# Altium schematic sheet Balancing_FETs.SchDoc
size A4; Organization: TESLA Motors, INC; Address1: 3500 Deer Creek Road; Address2: Palo Alto, CA; Address4: U.S.A.; SheetNumber: 4; SheetTotal: 8
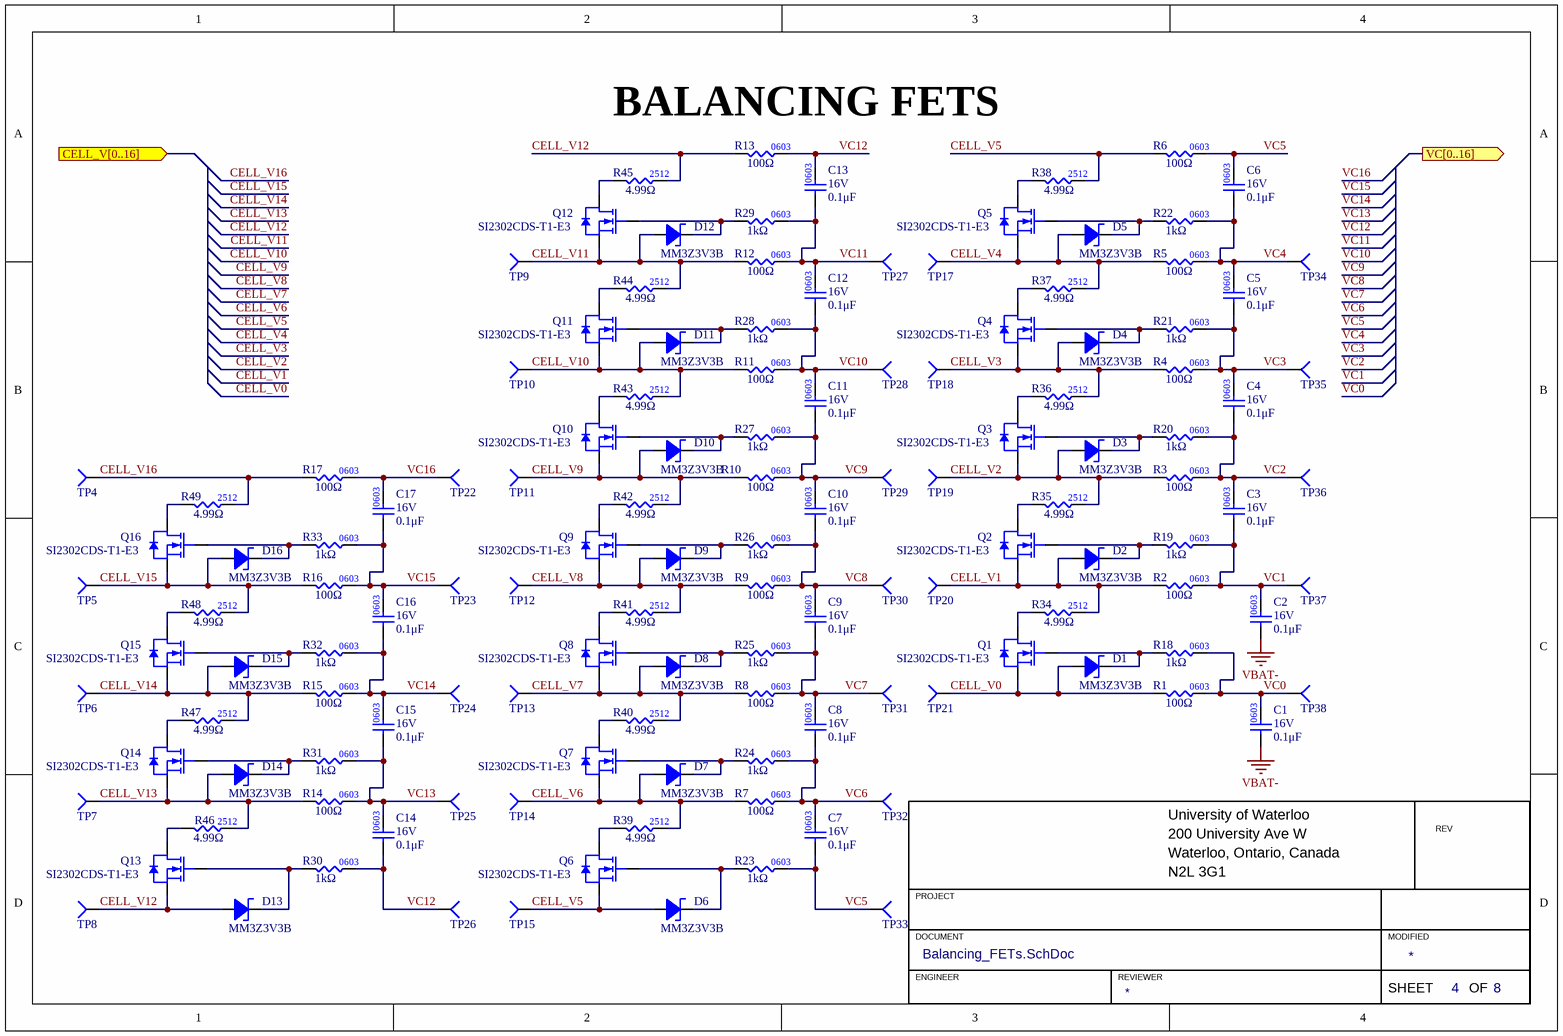
[diagram p0: Balancing_FETs.SchDoc]

## Parts
C1  value 0.1μF  Voltage Rating: 16V  [CAP0603]  (hidden comment: CAP_0.1uF_16V_0603)
C2  value 0.1μF  Voltage Rating: 16V  [CAP0603]  (hidden comment: CAP_0.1uF_16V_0603)
C3  value 0.1μF  Voltage Rating: 16V  [CAP0603]  (hidden comment: CAP_0.1uF_16V_0603)
C4  value 0.1μF  Voltage Rating: 16V  [CAP0603]  (hidden comment: CAP_0.1uF_16V_0603)
C5  value 0.1μF  Voltage Rating: 16V  [CAP0603]  (hidden comment: CAP_0.1uF_16V_0603)
C6  value 0.1μF  Voltage Rating: 16V  [CAP0603]  (hidden comment: CAP_0.1uF_16V_0603)
C7  value 0.1μF  Voltage Rating: 16V  [CAP0603]  (hidden comment: CAP_0.1uF_16V_0603)
C8  value 0.1μF  Voltage Rating: 16V  [CAP0603]  (hidden comment: CAP_0.1uF_16V_0603)
C9  value 0.1μF  Voltage Rating: 16V  [CAP0603]  (hidden comment: CAP_0.1uF_16V_0603)
C10  value 0.1μF  Voltage Rating: 16V  [CAP0603]  (hidden comment: CAP_0.1uF_16V_0603)
C11  value 0.1μF  Voltage Rating: 16V  [CAP0603]  (hidden comment: CAP_0.1uF_16V_0603)
C12  value 0.1μF  Voltage Rating: 16V  [CAP0603]  (hidden comment: CAP_0.1uF_16V_0603)
C13  value 0.1μF  Voltage Rating: 16V  [CAP0603]  (hidden comment: CAP_0.1uF_16V_0603)
C14  value 0.1μF  Voltage Rating: 16V  [CAP0603]  (hidden comment: CAP_0.1uF_16V_0603)
C15  value 0.1μF  Voltage Rating: 16V  [CAP0603]  (hidden comment: CAP_0.1uF_16V_0603)
C16  value 0.1μF  Voltage Rating: 16V  [CAP0603]  (hidden comment: CAP_0.1uF_16V_0603)
C17  value 0.1μF  Voltage Rating: 16V  [CAP0603]  (hidden comment: CAP_0.1uF_16V_0603)
D1  Manufacturer Part Number 1: MM3Z3V3B  [DIO_ZENER_3V3]  (hidden comment: DIO_ZENER_3V3)
D2  Manufacturer Part Number 1: MM3Z3V3B  [DIO_ZENER_3V3]  (hidden comment: DIO_ZENER_3V3)
D3  Manufacturer Part Number 1: MM3Z3V3B  [DIO_ZENER_3V3]  (hidden comment: DIO_ZENER_3V3)
D4  Manufacturer Part Number 1: MM3Z3V3B  [DIO_ZENER_3V3]  (hidden comment: DIO_ZENER_3V3)
D5  Manufacturer Part Number 1: MM3Z3V3B  [DIO_ZENER_3V3]  (hidden comment: DIO_ZENER_3V3)
D6  Manufacturer Part Number 1: MM3Z3V3B  [DIO_ZENER_3V3]  (hidden comment: DIO_ZENER_3V3)
D7  Manufacturer Part Number 1: MM3Z3V3B  [DIO_ZENER_3V3]  (hidden comment: DIO_ZENER_3V3)
D8  Manufacturer Part Number 1: MM3Z3V3B  [DIO_ZENER_3V3]  (hidden comment: DIO_ZENER_3V3)
D9  Manufacturer Part Number 1: MM3Z3V3B  [DIO_ZENER_3V3]  (hidden comment: DIO_ZENER_3V3)
D10  Manufacturer Part Number 1: MM3Z3V3B  [DIO_ZENER_3V3]  (hidden comment: DIO_ZENER_3V3)
D11  Manufacturer Part Number 1: MM3Z3V3B  [DIO_ZENER_3V3]  (hidden comment: DIO_ZENER_3V3)
D12  Manufacturer Part Number 1: MM3Z3V3B  [DIO_ZENER_3V3]  (hidden comment: DIO_ZENER_3V3)
D13  Manufacturer Part Number 1: MM3Z3V3B  [DIO_ZENER_3V3]  (hidden comment: DIO_ZENER_3V3)
D14  Manufacturer Part Number 1: MM3Z3V3B  [DIO_ZENER_3V3]  (hidden comment: DIO_ZENER_3V3)
D15  Manufacturer Part Number 1: MM3Z3V3B  [DIO_ZENER_3V3]  (hidden comment: DIO_ZENER_3V3)
D16  Manufacturer Part Number 1: MM3Z3V3B  [DIO_ZENER_3V3]  (hidden comment: DIO_ZENER_3V3)
Q1  Manufacturer Part Number 1: SI2302CDS-T1-E3  [SOT23-3]  (hidden comment: NMOS_20V_6A)
Q2  Manufacturer Part Number 1: SI2302CDS-T1-E3  [SOT23-3]  (hidden comment: NMOS_20V_6A)
Q3  Manufacturer Part Number 1: SI2302CDS-T1-E3  [SOT23-3]  (hidden comment: NMOS_20V_6A)
Q4  Manufacturer Part Number 1: SI2302CDS-T1-E3  [SOT23-3]  (hidden comment: NMOS_20V_6A)
Q5  Manufacturer Part Number 1: SI2302CDS-T1-E3  [SOT23-3]  (hidden comment: NMOS_20V_6A)
Q6  Manufacturer Part Number 1: SI2302CDS-T1-E3  [SOT23-3]  (hidden comment: NMOS_20V_6A)
Q7  Manufacturer Part Number 1: SI2302CDS-T1-E3  [SOT23-3]  (hidden comment: NMOS_20V_6A)
Q8  Manufacturer Part Number 1: SI2302CDS-T1-E3  [SOT23-3]  (hidden comment: NMOS_20V_6A)
Q9  Manufacturer Part Number 1: SI2302CDS-T1-E3  [SOT23-3]  (hidden comment: NMOS_20V_6A)
Q10  Manufacturer Part Number 1: SI2302CDS-T1-E3  [SOT23-3]  (hidden comment: NMOS_20V_6A)
Q11  Manufacturer Part Number 1: SI2302CDS-T1-E3  [SOT23-3]  (hidden comment: NMOS_20V_6A)
Q12  Manufacturer Part Number 1: SI2302CDS-T1-E3  [SOT23-3]  (hidden comment: NMOS_20V_6A)
Q13  Manufacturer Part Number 1: SI2302CDS-T1-E3  [SOT23-3]  (hidden comment: NMOS_20V_6A)
Q14  Manufacturer Part Number 1: SI2302CDS-T1-E3  [SOT23-3]  (hidden comment: NMOS_20V_6A)
Q15  Manufacturer Part Number 1: SI2302CDS-T1-E3  [SOT23-3]  (hidden comment: NMOS_20V_6A)
Q16  Manufacturer Part Number 1: SI2302CDS-T1-E3  [SOT23-3]  (hidden comment: NMOS_20V_6A)
R1  value 100Ω  [RES0603]  (hidden comment: RES_100Ω_0603_1%)
R2  value 100Ω  [RES0603]  (hidden comment: RES_100Ω_0603_1%)
R3  value 100Ω  [RES0603]  (hidden comment: RES_100Ω_0603_1%)
R4  value 100Ω  [RES0603]  (hidden comment: RES_100Ω_0603_1%)
R5  value 100Ω  [RES0603]  (hidden comment: RES_100Ω_0603_1%)
R6  value 100Ω  [RES0603]  (hidden comment: RES_100Ω_0603_1%)
R7  value 100Ω  [RES0603]  (hidden comment: RES_100Ω_0603_1%)
R8  value 100Ω  [RES0603]  (hidden comment: RES_100Ω_0603_1%)
R9  value 100Ω  [RES0603]  (hidden comment: RES_100Ω_0603_1%)
R10  value 100Ω  [RES0603]  (hidden comment: RES_100Ω_0603_1%)
R11  value 100Ω  [RES0603]  (hidden comment: RES_100Ω_0603_1%)
R12  value 100Ω  [RES0603]  (hidden comment: RES_100Ω_0603_1%)
R13  value 100Ω  [RES0603]  (hidden comment: RES_100Ω_0603_1%)
R14  value 100Ω  [RES0603]  (hidden comment: RES_100Ω_0603_1%)
R15  value 100Ω  [RES0603]  (hidden comment: RES_100Ω_0603_1%)
R16  value 100Ω  [RES0603]  (hidden comment: RES_100Ω_0603_1%)
R17  value 100Ω  [RES0603]  (hidden comment: RES_100Ω_0603_1%)
R18  value 1kΩ  [RES0603]  (hidden comment: RES_1kΩ_0603_1%)
R19  value 1kΩ  [RES0603]  (hidden comment: RES_1kΩ_0603_1%)
R20  value 1kΩ  [RES0603]  (hidden comment: RES_1kΩ_0603_1%)
R21  value 1kΩ  [RES0603]  (hidden comment: RES_1kΩ_0603_1%)
R22  value 1kΩ  [RES0603]  (hidden comment: RES_1kΩ_0603_1%)
R23  value 1kΩ  [RES0603]  (hidden comment: RES_1kΩ_0603_1%)
R24  value 1kΩ  [RES0603]  (hidden comment: RES_1kΩ_0603_1%)
R25  value 1kΩ  [RES0603]  (hidden comment: RES_1kΩ_0603_1%)
R26  value 1kΩ  [RES0603]  (hidden comment: RES_1kΩ_0603_1%)
R27  value 1kΩ  [RES0603]  (hidden comment: RES_1kΩ_0603_1%)
R28  value 1kΩ  [RES0603]  (hidden comment: RES_1kΩ_0603_1%)
R29  value 1kΩ  [RES0603]  (hidden comment: RES_1kΩ_0603_1%)
R30  value 1kΩ  [RES0603]  (hidden comment: RES_1kΩ_0603_1%)
R31  value 1kΩ  [RES0603]  (hidden comment: RES_1kΩ_0603_1%)
R32  value 1kΩ  [RES0603]  (hidden comment: RES_1kΩ_0603_1%)
R33  value 1kΩ  [RES0603]  (hidden comment: RES_1kΩ_0603_1%)
R34  value 4.99Ω  [RES2512]  (hidden comment: RES_4.99Ω_2512_1%)
R35  value 4.99Ω  [RES2512]  (hidden comment: RES_4.99Ω_2512_1%)
R36  value 4.99Ω  [RES2512]  (hidden comment: RES_4.99Ω_2512_1%)
R37  value 4.99Ω  [RES2512]  (hidden comment: RES_4.99Ω_2512_1%)
R38  value 4.99Ω  [RES2512]  (hidden comment: RES_4.99Ω_2512_1%)
R39  value 4.99Ω  [RES2512]  (hidden comment: RES_4.99Ω_2512_1%)
R40  value 4.99Ω  [RES2512]  (hidden comment: RES_4.99Ω_2512_1%)
R41  value 4.99Ω  [RES2512]  (hidden comment: RES_4.99Ω_2512_1%)
R42  value 4.99Ω  [RES2512]  (hidden comment: RES_4.99Ω_2512_1%)
R43  value 4.99Ω  [RES2512]  (hidden comment: RES_4.99Ω_2512_1%)
R44  value 4.99Ω  [RES2512]  (hidden comment: RES_4.99Ω_2512_1%)
R45  value 4.99Ω  [RES2512]  (hidden comment: RES_4.99Ω_2512_1%)
R46  value 4.99Ω  [RES2512]  (hidden comment: RES_4.99Ω_2512_1%)
R47  value 4.99Ω  [RES2512]  (hidden comment: RES_4.99Ω_2512_1%)
R48  value 4.99Ω  [RES2512]  (hidden comment: RES_4.99Ω_2512_1%)
R49  value 4.99Ω  [RES2512]  (hidden comment: RES_4.99Ω_2512_1%)
TP4  TESTPOINT_1MM_SQUARE  [TESTPOINT_SQUARE_1MM]  (value not drawn)  (no BOM)
TP5  TESTPOINT_1MM_SQUARE  [TESTPOINT_SQUARE_1MM]  (value not drawn)  (no BOM)
TP6  TESTPOINT_1MM_SQUARE  [TESTPOINT_SQUARE_1MM]  (value not drawn)  (no BOM)
TP7  TESTPOINT_1MM_SQUARE  [TESTPOINT_SQUARE_1MM]  (value not drawn)  (no BOM)
TP8  TESTPOINT_1MM_SQUARE  [TESTPOINT_SQUARE_1MM]  (value not drawn)  (no BOM)
TP9  TESTPOINT_1MM_SQUARE  [TESTPOINT_SQUARE_1MM]  (value not drawn)  (no BOM)
TP10  TESTPOINT_1MM_SQUARE  [TESTPOINT_SQUARE_1MM]  (value not drawn)  (no BOM)
TP11  TESTPOINT_1MM_SQUARE  [TESTPOINT_SQUARE_1MM]  (value not drawn)  (no BOM)
TP12  TESTPOINT_1MM_SQUARE  [TESTPOINT_SQUARE_1MM]  (value not drawn)  (no BOM)
TP13  TESTPOINT_1MM_SQUARE  [TESTPOINT_SQUARE_1MM]  (value not drawn)  (no BOM)
TP14  TESTPOINT_1MM_SQUARE  [TESTPOINT_SQUARE_1MM]  (value not drawn)  (no BOM)
TP15  TESTPOINT_1MM_SQUARE  [TESTPOINT_SQUARE_1MM]  (value not drawn)  (no BOM)
TP17  TESTPOINT_1MM_SQUARE  [TESTPOINT_SQUARE_1MM]  (value not drawn)  (no BOM)
TP18  TESTPOINT_1MM_SQUARE  [TESTPOINT_SQUARE_1MM]  (value not drawn)  (no BOM)
TP19  TESTPOINT_1MM_SQUARE  [TESTPOINT_SQUARE_1MM]  (value not drawn)  (no BOM)
TP20  TESTPOINT_1MM_SQUARE  [TESTPOINT_SQUARE_1MM]  (value not drawn)  (no BOM)
TP21  TESTPOINT_1MM_SQUARE  [TESTPOINT_SQUARE_1MM]  (value not drawn)  (no BOM)
TP22  TESTPOINT_1MM_SQUARE  [TESTPOINT_SQUARE_1MM]  (value not drawn)  (no BOM)
TP23  TESTPOINT_1MM_SQUARE  [TESTPOINT_SQUARE_1MM]  (value not drawn)  (no BOM)
TP24  TESTPOINT_1MM_SQUARE  [TESTPOINT_SQUARE_1MM]  (value not drawn)  (no BOM)
TP25  TESTPOINT_1MM_SQUARE  [TESTPOINT_SQUARE_1MM]  (value not drawn)  (no BOM)
TP26  TESTPOINT_1MM_SQUARE  [TESTPOINT_SQUARE_1MM]  (value not drawn)  (no BOM)
TP27  TESTPOINT_1MM_SQUARE  [TESTPOINT_SQUARE_1MM]  (value not drawn)  (no BOM)
TP28  TESTPOINT_1MM_SQUARE  [TESTPOINT_SQUARE_1MM]  (value not drawn)  (no BOM)
TP29  TESTPOINT_1MM_SQUARE  [TESTPOINT_SQUARE_1MM]  (value not drawn)  (no BOM)
TP30  TESTPOINT_1MM_SQUARE  [TESTPOINT_SQUARE_1MM]  (value not drawn)  (no BOM)
TP31  TESTPOINT_1MM_SQUARE  [TESTPOINT_SQUARE_1MM]  (value not drawn)  (no BOM)
TP32  TESTPOINT_1MM_SQUARE  [TESTPOINT_SQUARE_1MM]  (value not drawn)  (no BOM)
TP33  TESTPOINT_1MM_SQUARE  [TESTPOINT_SQUARE_1MM]  (value not drawn)  (no BOM)
TP34  TESTPOINT_1MM_SQUARE  [TESTPOINT_SQUARE_1MM]  (value not drawn)  (no BOM)
TP35  TESTPOINT_1MM_SQUARE  [TESTPOINT_SQUARE_1MM]  (value not drawn)  (no BOM)
TP36  TESTPOINT_1MM_SQUARE  [TESTPOINT_SQUARE_1MM]  (value not drawn)  (no BOM)
TP37  TESTPOINT_1MM_SQUARE  [TESTPOINT_SQUARE_1MM]  (value not drawn)  (no BOM)
TP38  TESTPOINT_1MM_SQUARE  [TESTPOINT_SQUARE_1MM]  (value not drawn)  (no BOM)

## Ports
CELL_V[0..16] (in), VC[0..16] (out)

## Nets
VBAT-: C1.1 C2.1
CELL_V0: D1.1(Anode) Q1.2(SOURCE) R1.1 TP21.1(=value)
CELL_V1: D2.1(Anode) Q2.2(SOURCE) R2.1 R34.2 TP20.1(=value)
CELL_V2: D3.1(Anode) Q3.2(SOURCE) R3.1 R35.2 TP19.1(=value)
CELL_V3: D4.1(Anode) Q4.2(SOURCE) R4.1 R36.2 TP18.1(=value)
CELL_V4: D5.1(Anode) Q5.2(SOURCE) R5.1 R37.2 TP17.1(=value)
CELL_V5: D6.1(Anode) Q6.2(SOURCE) R6.1 R38.2 TP15.1(=value)
CELL_V6: D7.1(Anode) Q7.2(SOURCE) R7.1 R39.2 TP14.1(=value)
CELL_V7: D8.1(Anode) Q8.2(SOURCE) R8.1 R40.2 TP13.1(=value)
CELL_V8: D9.1(Anode) Q9.2(SOURCE) R9.1 R41.2 TP12.1(=value)
CELL_V9: D10.1(Anode) Q10.2(SOURCE) R10.1 R42.2 TP11.1(=value)
CELL_V10: D11.1(Anode) Q11.2(SOURCE) R11.1 R43.2 TP10.1(=value)
CELL_V11: D12.1(Anode) Q12.2(SOURCE) R12.1 R44.2 TP9.1(=value)
CELL_V12: D13.1(Anode) Q13.2(SOURCE) R13.1 R45.2 TP8.1(=value)
CELL_V13: D14.1(Anode) Q14.2(SOURCE) R14.1 R46.2 TP7.1(=value)
CELL_V14: D15.1(Anode) Q15.2(SOURCE) R15.1 R47.2 TP6.1(=value)
CELL_V15: D16.1(Anode) Q16.2(SOURCE) R16.1 R48.2 TP5.1(=value)
CELL_V16: R17.1 R49.2 TP4.1(=value)
VC0: C1.2 R1.2 R18.2 TP38.1(=value)
VC1: C2.2 C3.1 R2.2 R19.2 TP37.1(=value)
VC2: C3.2 C4.1 R3.2 R20.2 TP36.1(=value)
VC3: C4.2 C5.1 R4.2 R21.2 TP35.1(=value)
VC4: C5.2 C6.1 R5.2 R22.2 TP34.1(=value)
VC5: C6.2 C7.1 R6.2 R23.2 TP33.1(=value)
VC6: C7.2 C8.1 R7.2 R24.2 TP32.1(=value)
VC7: C8.2 C9.1 R8.2 R25.2 TP31.1(=value)
VC8: C9.2 C10.1 R9.2 R26.2 TP30.1(=value)
VC9: C10.2 C11.1 R10.2 R27.2 TP29.1(=value)
VC10: C11.2 C12.1 R11.2 R28.2 TP28.1(=value)
VC11: C12.2 C13.1 R12.2 R29.2 TP27.1(=value)
VC12: C13.2 C14.1 R13.2 R30.2 TP26.1(=value)
VC13: C14.2 C15.1 R14.2 R31.2 TP25.1(=value)
VC14: C15.2 C16.1 R15.2 R32.2 TP24.1(=value)
VC15: C16.2 C17.1 R16.2 R33.2 TP23.1(=value)
VC16: C17.2 R17.2 TP22.1(=value)
NetD1_2: D1.2(Cathode) Q1.1(GATE) R18.1
NetD2_2: D2.2(Cathode) Q2.1(GATE) R19.1
NetD3_2: D3.2(Cathode) Q3.1(GATE) R20.1
NetD4_2: D4.2(Cathode) Q4.1(GATE) R21.1
NetD5_2: D5.2(Cathode) Q5.1(GATE) R22.1
NetD6_2: D6.2(Cathode) Q6.1(GATE) R23.1
NetD7_2: D7.2(Cathode) Q7.1(GATE) R24.1
NetD8_2: D8.2(Cathode) Q8.1(GATE) R25.1
NetD9_2: D9.2(Cathode) Q9.1(GATE) R26.1
NetD10_2: D10.2(Cathode) Q10.1(GATE) R27.1
NetD11_2: D11.2(Cathode) Q11.1(GATE) R28.1
NetD12_2: D12.2(Cathode) Q12.1(GATE) R29.1
NetD13_2: D13.2(Cathode) Q13.1(GATE) R30.1
NetD14_2: D14.2(Cathode) Q14.1(GATE) R31.1
NetD15_2: D15.2(Cathode) Q15.1(GATE) R32.1
NetD16_2: D16.2(Cathode) Q16.1(GATE) R33.1
NetQ1_3: Q1.3(DRAIN) R34.1
NetQ2_3: Q2.3(DRAIN) R35.1
NetQ3_3: Q3.3(DRAIN) R36.1
NetQ4_3: Q4.3(DRAIN) R37.1
NetQ5_3: Q5.3(DRAIN) R38.1
NetQ6_3: Q6.3(DRAIN) R39.1
NetQ7_3: Q7.3(DRAIN) R40.1
NetQ8_3: Q8.3(DRAIN) R41.1
NetQ9_3: Q9.3(DRAIN) R42.1
NetQ10_3: Q10.3(DRAIN) R43.1
NetQ11_3: Q11.3(DRAIN) R44.1
NetQ12_3: Q12.3(DRAIN) R45.1
NetQ13_3: Q13.3(DRAIN) R46.1
NetQ14_3: Q14.3(DRAIN) R47.1
NetQ15_3: Q15.3(DRAIN) R48.1
NetQ16_3: Q16.3(DRAIN) R49.1

## Notes on the sheet
- (near R13) BALANCING FETS
- University of Waterloo
- 200 University Ave W
- REV
- (near TP33) PROJECT
- Waterloo, Ontario, Canada
- N2L 3G1
- (near TP33) DOCUMENT
- ENGINEER
- REVIEWER
- MODIFIED
- SHEET
- OF
- (in symbol RES_4.99Ω_2512_1%) 2512
- (in symbol RES_100Ω_0603_1%) 0603

## Library data of the parts
C1-C17 = CAP_0.1uF_16V_0603: CAP CER 0.1UF 16V X7R 0603; Manufacturer Part Number 1: CC0603KRX7R7BB104; Manufacturer 1: Yageo; Package: 0603; Supplier Part Number 1: 311-1088-1-ND; Supplier 1: Digi-Key; Dielectric: X7R
D1-D16 = DIO_ZENER_3V3: DIODE ZENER 3.3V 200mW SOD323F; Manufacturer 1: ON Semiconductor / Fairchild; Forward Voltage: 1V; Supplier Part Number 1: MM3Z3V3BCT-ND; Supplier 1: Digi-Key; Package/Case: SOD323F; Working Voltage: 3.3V
Q1-Q16 = NMOS_20V_2.6A: MOSFET N-CH 20V 2.6A SOT23-3; Manufacturer 1: Vishay Siliconix; Package/Footprint: SOT-23-3; Supplier 1: Digi-Key; Supplier Part Number 1: SI2302CDS-T1-E3CT-ND
R1-R17 = RES_100Ω_0603_1%: RES 100 OHM 1% 1/10W 0603; Manufacturer 1: Yageo; Manufacturer Part Number 1: RC0603FR-07100RL; Supplier Part Number 1: 311-100HRCT-ND; Supplier 1: Digi-Key
R18-R33 = RES_1kΩ_0603_1%: RES 1K OHM 1% 1/8W 0603; Manufacturer 1: Stackpole Electronics Inc; Manufacturer Part Number 1: RNCP0603FTD1K00; Supplier Part Number 1: RNCP0603FTD1K00CT-ND; Supplier 1: Digi-Key; Mounting Type: SMD; Package: 0603
R34-R49 = RES_4.99Ω_2512_1%: RES 4.99 OHM 1% 2W 2512; Manufacturer 1: Stackpole Electronics Inc; Manufacturer Part Number 1: RHC2512FT4R99; Supplier 1: Digi-Key; Supplier Part Number 1: RHC2512FT4R99CT-ND
TP4-TP15 TP17-TP38 = TESTPOINT_1MM_SQUARE: TESTPOINT 1MM SQUARE